# EAGLE design Schematic (EAGLE 8.6.0)
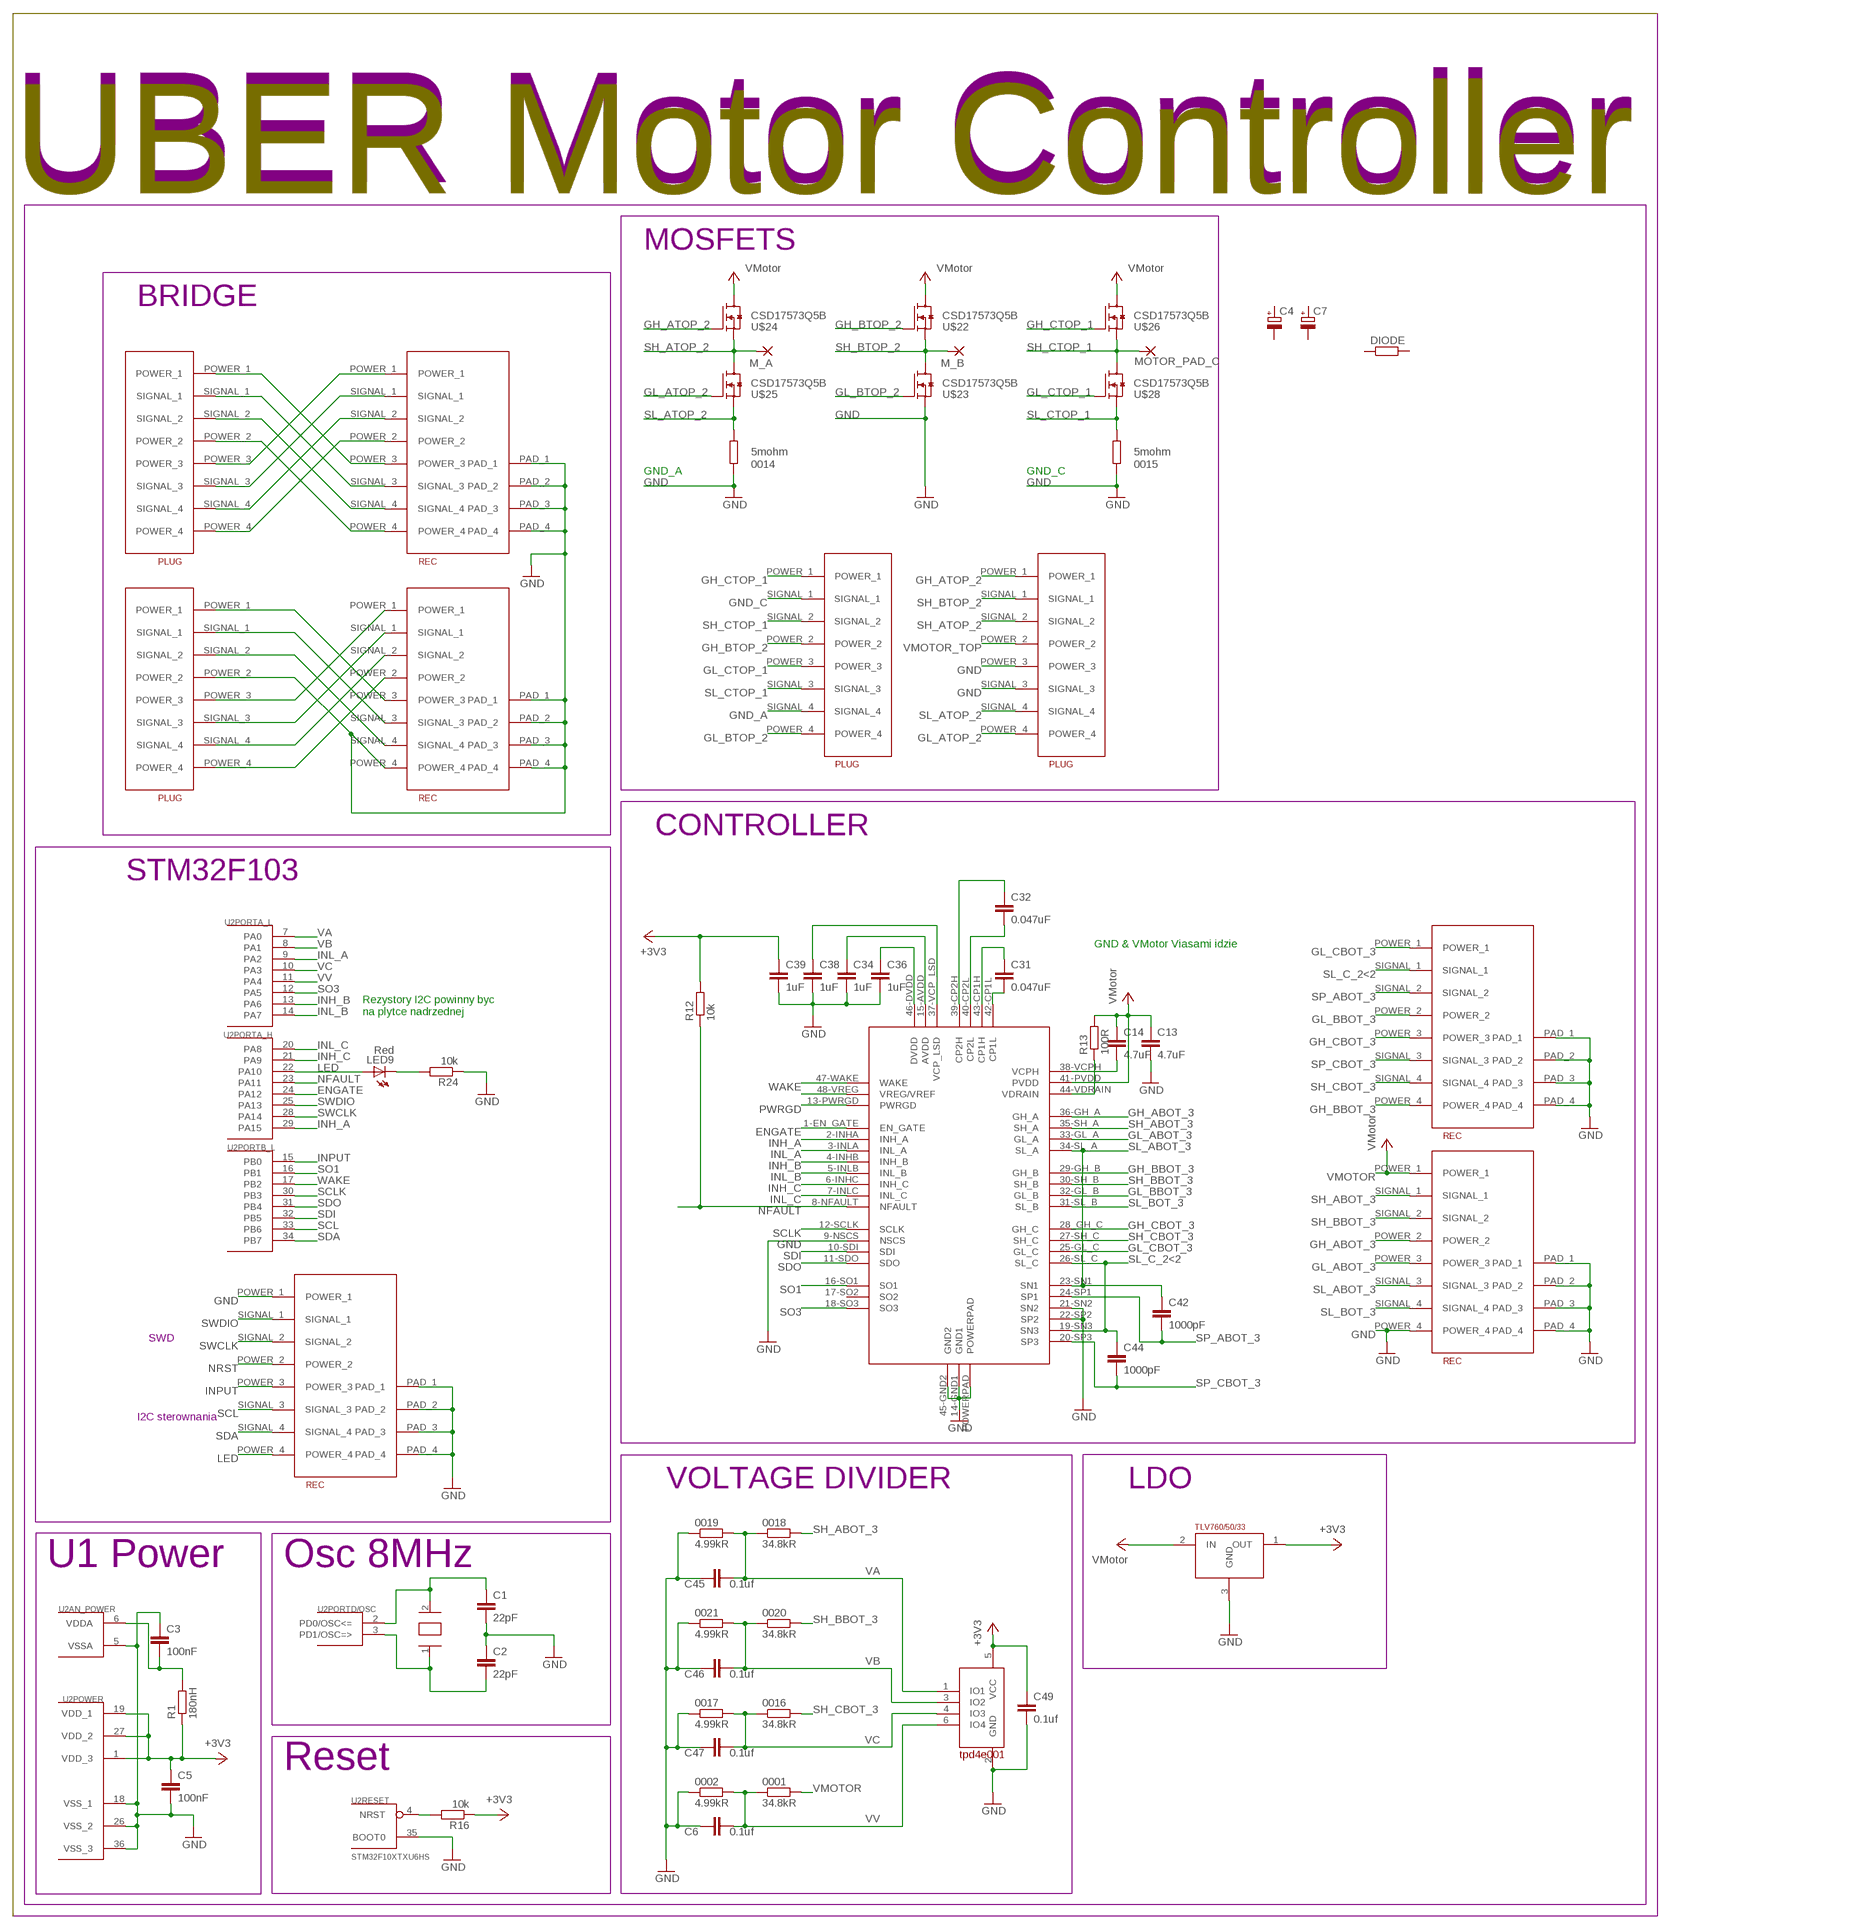
[diagram p0: schematic, sheet 1]

## Parts
0001  34.8kR  R-EU_R0603  [R0603]
0002  4.99kR  R-EU_R0603  [R0603]
0014  5mohm  R-EU_R2512  [R2512]
0015  5mohm  R-EU_R2512  [R2512]
0016  34.8kR  R-EU_R0603  [R0603]
0017  4.99kR  R-EU_R0603  [R0603]
0018  34.8kR  R-EU_R0603  [R0603]
0019  4.99kR  R-EU_R0603  [R0603]
0020  34.8kR  R-EU_R0603  [R0603]
0021  4.99kR  R-EU_R0603  [R0603]
C1  22pF  C-EUC0603  [C0603]
C2  22pF  C-EUC0603  [C0603]
C3  100nF  C-EUC0603  [C0603]
C4  CPOL-EU153CLV-0807  [153CLV-0807]
C5  100nF  C-EUC0603  [C0603]
C6  0.1uf  C-EUC0603  [C0603]
C7  CPOL-EU153CLV-0807  [153CLV-0807]
C13  4.7uF  C-EUC0805  [C0805]
C14  4.7uF  C-EUC0805  [C0805]
C31  0.047uF  C-EUC0603  [C0603]
C32  0.047uF  C-EUC0603  [C0603]
C34  1uF  C-EUC0603  [C0603]
C36  1uF  C-EUC0603  [C0603]
C38  1uF  C-EUC0603  [C0603]
C39  1uF  C-EUC0603  [C0603]
C42  1000pF  C-EUC0603  [C0603]
C44  1000pF  C-EUC0603  [C0603]
C45  0.1uf  C-EUC0603  [C0603]
C46  0.1uf  C-EUC0603  [C0603]
C47  0.1uf  C-EUC0603  [C0603]
C49  0.1uf  C-EUC0603  [C0603]
DIODE  R-EU_R0805  [R0805]
LED9  Red  LEDSML0603  [SML0603]
M_A  SMD5  [SMD2,54-5,08]
M_B  SMD5  [SMD2,54-5,08]
MOTOR_PAD_C  SMD5  [SMD2,54-5,08]
R1  180nH  R-EU_R0603  [R0603]
R12  10k  R-EU_R0603  [R0603]
R13  100R  R-EU_R0603  [R0603]
R16  10k  R-EU_R0603  [R0603]
R24  10k  R-EU_R0603  [R0603]
U2  STM32F10XTXU6HS  [VFQFPN36-HS]
U$1  MOLEG_REC_8X0.4MM  [REC]
U$2  MOLEG_REC_8X0.4MM  [REC]
U$3  MOLEX_PLUG_8X0.4MM  [PLUG]
U$4  MOLEG_REC_8X0.4MM  [REC]
U$5  MOLEG_REC_8X0.4MM  [REC]
U$6  MOLEX_PLUG_8X0.4MM  [PLUG]
U$7  MOLEX_PLUG_8X0.4MM  [PLUG]
U$8  MOLEX_PLUG_8X0.4MM  [PLUG]
U$9  MOLEG_REC_8X0.4MM  [REC]
U$10  OSC_8MHZ  [SMD_MINI]
U$11  TLV760XX  [SOT-23-3]
U$21  DRV8305  [S-PQFP-G48]
U$22  CSD17573Q5B  [Q5B]
U$23  CSD17573Q5B  [Q5B]
U$24  CSD17573Q5B  [Q5B]
U$25  CSD17573Q5B  [Q5B]
U$26  CSD17573Q5B  [Q5B]
U$28  CSD17573Q5B  [Q5B]
U$31  TPD4E001  [SOT-23]

## Nets
+3V3: C5.1 C39.1 C49.1 R1.1 R12.2 R16.1 U2.1(POWER:VDD_3) U2.19(POWER:VDD_1) U2.27(POWER:VDD_2) U$11.1(OUT) U$31.5(VCC)
ENGATE: U2.24(PORTA_H:PA12) U$21.1-EN_GATE(EN_GATE)
GH_ABOT_3: U$9.POWER_2 U$21.36-GH_A(GH_A)
GH_ATOP_2: U$3.POWER_1 U$24.G
GH_BBOT_3: U$4.POWER_4 U$21.29-GH_B(GH_B)
GH_BTOP_2: U$6.POWER_2 U$22.G
GH_CBOT_3: U$4.POWER_3 U$21.28_GH_C(GH_C)
GH_CTOP_1: U$6.POWER_1 U$26.G
GL_ABOT_3: U$9.POWER_3 U$21.33-GL_A(GL_A)
GL_ATOP_2: U$3.POWER_4 U$25.G
GL_BBOT_3: U$4.POWER_2 U$21.32-GL_B(GL_B)
GL_BTOP_2: U$6.POWER_4 U$23.G
GL_CBOT_3: U$4.POWER_1 U$21.25-GL_C(GL_C)
GL_CTOP_1: U$6.POWER_3 U$28.G
GND: 0002.1 0014.1 0015.1 0017.1 0019.1 0021.1 C1.2 C2.1 C3.1 C5.2 C6.2 C13.2 C34.2 C36.2 C38.2 C39.2 C45.2 C46.2 C47.2 C49.2 R24.1 U2.5(AN_POWER:VSSA) U2.18(POWER:VSS_1) U2.26(POWER:VSS_2) U2.35(RESET:BOOT0) U2.36(POWER:VSS_3) U$1.PAD_1 U$1.PAD_2 U$1.PAD_3 U$1.PAD_4 U$2.PAD_1 U$2.PAD_2 U$2.PAD_3 U$2.PAD_4 U$2.POWER_1 U$3.POWER_3 U$3.SIGNAL_3 U$4.PAD_1 U$4.PAD_2 U$4.PAD_3 U$4.PAD_4 U$5.PAD_1 U$5.PAD_2 U$5.PAD_3 U$5.PAD_4 U$5.POWER_4 U$8.POWER_2 U$9.PAD_1 U$9.PAD_2 U$9.PAD_3 U$9.PAD_4 U$9.POWER_4 U$11.3(GND) U$21.9-NSCS(NSCS) U$21.14-GND1(GND1) U$21.21-SN2(SN2) U$21.22-SP2(SP2) U$21.45-GND2(GND2) U$21.POWERPAD U$23.S1(S) U$23.S2(S) U$23.S3(S) U$31.2(GND)
GND_A: U$6.SIGNAL_4
GND_C: U$6.SIGNAL_1
INH_A: U2.29(PORTA_H:PA15) U$21.2-INHA(INH_A)
INH_B: U2.13(PORTA_L:PA6) U$21.4-INHB(INH_B)
INH_C: U2.21(PORTA_H:PA9) U$21.6-INHC(INH_C)
INL_A: U2.9(PORTA_L:PA2) U$21.3-INLA(INL_A)
INL_B: U2.14(PORTA_L:PA7) U$21.5-INLB(INL_B)
INL_C: U2.20(PORTA_H:PA8) U$21.7-INLC(INL_C)
INPUT: U2.15(PORTB_L:PB0) U$2.POWER_3
LED: LED9.A U2.22(PORTA_H:PA10) U$2.POWER_4
N$2: U$21.48-VREG(VREG/VREF)
N$3: U$5.POWER_3 U$8.POWER_1
N$4: U$5.SIGNAL_3 U$8.SIGNAL_1
N$5: U$5.SIGNAL_4 U$8.SIGNAL_2
N$7: U$1.POWER_3 U$7.POWER_1
N$8: U$1.SIGNAL_3 U$7.SIGNAL_1
N$9: U$1.SIGNAL_4 U$7.SIGNAL_2
N$10: C36.1 U$21.46-DVDD(DVDD)
N$11: U$1.POWER_4 U$7.POWER_2
N$12: C34.1 U$21.15-AVDD(AVDD)
N$13: C38.1 U$21.37-VCP_LSD(VCP_LSD)
N$14: C31.2 U$21.42-CP1L(CP1L)
N$15: U$5.POWER_1 U$8.POWER_3
N$16: C31.1 U$21.43-CP1H(CP1H)
N$17: U$5.SIGNAL_1 U$8.SIGNAL_3
N$18: U$5.SIGNAL_2 U$8.SIGNAL_4
N$19: U$5.POWER_2 U$8.POWER_4
N$20: C32.2 U$21.40-CP2L(CP2L)
N$21: C32.1 U$21.39-CP2H(CP2H)
N$22: R13.1 U$21.44-VDRAIN(VDRAIN)
N$23: C14.2 U$21.38-VCPH(VCPH)
N$24: C1.1 U2.2(PORTD/OSC:PD0/OSC<=) U$10.2
N$25: U$1.POWER_1 U$7.POWER_3
N$26: U$1.SIGNAL_1 U$7.SIGNAL_3
N$27: U$1.SIGNAL_2 U$7.SIGNAL_4
N$28: U$1.POWER_2 U$7.POWER_4
N$45: C3.2 R1.2 U2.6(AN_POWER:VDDA)
N$53: C2.2 U2.3(PORTD/OSC:PD1/OSC=>) U$10.1
N$81: LED9.C R24.2
NFAULT: R12.1 U2.23(PORTA_H:PA11) U$21.8-NFAULT(NFAULT)
NRST: R16.2 U2.4(RESET:NRST) U$2.POWER_2
PWRGD: U$21.13-PWRGD(PWRGD)
SCL: U2.33(PORTB_L:PB6) U$2.SIGNAL_3
SCLK: U2.30(PORTB_L:PB3) U$21.12-SCLK(SCLK)
SDA: U2.34(PORTB_L:PB7) U$2.SIGNAL_4
SDI: U2.32(PORTB_L:PB5) U$21.10-SDI(SDI)
SDO: U2.31(PORTB_L:PB4) U$21.11-SDO(SDO)
SH_ABOT_3: 0018.2 U$9.SIGNAL_1 U$21.35-SH_A(SH_A)
SH_ATOP_2: M_A.1(P) U$3.SIGNAL_2 U$24.S1(S) U$24.S2(S) U$24.S3(S) U$25.D1(D) U$25.D2(D) U$25.D3(D) U$25.D4(D) U$25.D5(D)
SH_BBOT_3: 0020.2 U$9.SIGNAL_2 U$21.30-SH_B(SH_B)
SH_BTOP_2: M_B.1(P) U$3.SIGNAL_1 U$22.S1(S) U$22.S2(S) U$22.S3(S) U$23.D1(D) U$23.D2(D) U$23.D3(D) U$23.D4(D) U$23.D5(D)
SH_CBOT_3: 0016.2 U$4.SIGNAL_4 U$21.27-SH_C(SH_C)
SH_CTOP_1: MOTOR_PAD_C.1(P) U$6.SIGNAL_2 U$26.S1(S) U$26.S2(S) U$26.S3(S) U$28.D1(D) U$28.D2(D) U$28.D3(D) U$28.D4(D) U$28.D5(D)
SL_ABOT_3: C42.1 U$9.SIGNAL_3 U$21.23-SN1(SN1) U$21.34-SL_A(SL_A)
SL_ATOP_2: 0014.2 U$3.SIGNAL_4 U$25.S1(S) U$25.S2(S) U$25.S3(S)
SL_BOT_3: U$9.SIGNAL_4 U$21.31-SL_B(SL_B)
SL_C_2<2: C44.1 U$4.SIGNAL_1 U$21.19-SN3(SN3) U$21.26-SL_C(SL_C)
SL_CTOP_1: 0015.2 U$6.SIGNAL_3 U$28.S1(S) U$28.S2(S) U$28.S3(S)
SO1: U2.16(PORTB_L:PB1) U$21.16-SO1(SO1)
SO3: U2.12(PORTA_L:PA5) U$21.18-SO3(SO3)
SP_ABOT_3: C42.2 U$4.SIGNAL_2 U$21.24-SP1(SP1)
SP_CBOT_3: C44.2 U$4.SIGNAL_3 U$21.20-SP3(SP3)
SWCLK: U2.28(PORTA_H:PA14) U$2.SIGNAL_2
SWDIO: U2.25(PORTA_H:PA13) U$2.SIGNAL_1
VA: 0018.1 0019.2 C45.1 U2.7(PORTA_L:PA0) U$31.1(IO1)
VB: 0020.1 0021.2 C46.1 U2.8(PORTA_L:PA1) U$31.3(IO2)
VC: 0016.1 0017.2 C47.1 U2.10(PORTA_L:PA3) U$31.4(IO3)
VMOTOR: 0001.2 C13.1 C14.1 R13.2 U$9.POWER_1 U$11.2(IN) U$21.41-PVDD(PVDD) ; supply symbol labelled VMotor
VMOTOR_TOP: U$3.POWER_2 U$22.D1(D) U$22.D2(D) U$22.D3(D) U$22.D4(D) U$22.D5(D) U$24.D1(D) U$24.D2(D) U$24.D3(D) U$24.D4(D) U$24.D5(D) U$26.D1(D) U$26.D2(D) U$26.D3(D) U$26.D4(D) U$26.D5(D) ; supply symbol labelled VMotor
VV: 0001.1 0002.2 C6.1 U2.11(PORTA_L:PA4) U$31.6(IO4)
WAKE: U2.17(PORTB_L:PB2) U$21.47-WAKE(WAKE)
Unconnected: C4.+ C4.- C7.+ C7.- DIODE.1 DIODE.2 U$21.17-SO2(SO2)

## Notes on the sheet
- UBER Motor Controller | UBER Motor Controller
- MOSFETS
- BRIDGE
- GND_A | GND_C
- CONTROLLER
- STM32F103
- GND & VMotor Viasami idzie
- Rezystory I2C powinny byc 
  na plytce nadrzednej
- SWD
- I2C sterownania
- VOLTAGE DIVIDER | LDO
- U1 Power | Osc 8MHz
- Reset

## Library data of the parts
0001 0002 0014-0021 R1 R12 R13 R16 R24 = resistor:R-EU_: RESISTOR, European symbol
C1-C3 C5 C6 C13 C14 C31 C32 C34 C36 C38 C39 C42 C44-C47 C49 = rcl:C-EU: CAPACITOR, European symbol; SPICEPREFIX: C
C4 C7 = rcl:CPOL-EU: POLARIZED CAPACITOR, European symbol; SPICEPREFIX: C
DIODE = rcl:R-EU_: RESISTOR, European symbol; SPICEPREFIX: R
LED9 = led:LED: LED OSRAM: - CHIPLED LG R971, LG N971, LY N971, LG Q971, LY Q971, LO R971, LY R971 LH N974, LH R974 LS Q976, LO Q976, LY Q976 LO Q996 - Hyper CHIPLED LW Q18S LB Q993, LB Q99A, LB R99A - SideLED LS A670, LO A670, LY A670, LG A670, LP A670 LB A673, LV A673, LT A673, LW A673 LH A674 LY A675 LS A676, LA A676, LO A676, LY A676, LW A676 LS A679, LY A679, LG A679 - Hyper Micro SIDELED® LS Y876, LA Y876, LO Y876, LY Y876 LT Y87S - SmartLED LW L88C, LW L88S LB L89C, LB L89S, LG L890 LS L89K, LO L89K, LY L89K LS L896, LA L896, LO L896, LY L896 - TOPLED LS T670, LO T670, LY T670, LG T670, LP T670 LSG T670, LSP T670, LSY T670, LOP T670, LYG T670 LG T671, LOG T671, LSG T671 LB T673, LV T673, LT T673, LW T673 LH T674 LS T676, LA T676, LO T676, LY T676, LB T676, LH T676, LSB T676, LW T676 LB T67C, LV T67C, LT T67C, LS T67K, LO T67K, LY T67K, LW E67C LS E67B, LA E67B, LO E67B, LY E67B, LB E67C, LV E67C, LT E67C LW T67C LS T679, LY T679, LG T679 LS T770, LO T770, LY T770, LG T770, LP T770 LB T773, LV T773, LT T773, LW T773 LH T774 LS E675, LA E675, LY E675, LS T675 LS T776, LA T776, LO T776, LY T776, LB T776 LHGB T686 LT T68C, LB T68C - Hyper Mini TOPLED® LB M676 - Mini TOPLED Santana® LG M470 LS M47K, LO M47K, LY M47K Source: http://www.osram.convergy.de LUXEON: - LUMILED® LXK2-PW12-R00, LXK2-PW12-S00, LXK2-PW14-U00, LXK2-PW14-V00 LXK2-PM12-R00, LXK2-PM12-S00, LXK2-PM14-U00 LXK2-PE12-Q00, LXK2-PE12-R00, LXK2-PE12-S00, LXK2-PE14-T00, LXK2-PE14-U00 LXK2-PB12-K00, LXK2-PB12-L00, LXK2-PB12-M00, LXK2-PB14-N00, LXK2-PB14-P00, LXK2-PB14-Q00 LXK2-PR12-L00, LXK2-PR12-M00, LXK2-PR14-Q00, LXK2-PR14-R00 LXK2-PD12-Q00, LXK2-PD12-R00, LXK2-PD12-S00 LXK2-PH12-R00, LXK2-PH12-S00 LXK2-PL12-P00, LXK2-PL12-Q00, LXK2-PL12-R00 Source: www.luxeon.com KINGBRIGHT: KA-3528ASYC Source: www.kingbright.com
M_A M_B MOTOR_PAD_C = wirepad:SMD5: SMD PAD
U2 = stm32:STM32F10XTXU6: STM32F101/103 36pad VFQPFN36
U$1 U$2 U$4 U$5 U$9 = MOLEX:MOLEG_REC_8X0.4MM
U$3 U$6-U$8 = MOLEX:MOLEX_PLUG_8X0.4MM
U$10 = OSC_8MHZ:OSC_8MHZ
U$11 = Zestaw:TLV760XX
U$21 = drv8305lbr:DRV8305
U$22-U$26 U$28 = CSD_Mosfet:CSD17573Q5B
U$31 = tpd4e001:TPD4E001

## Board
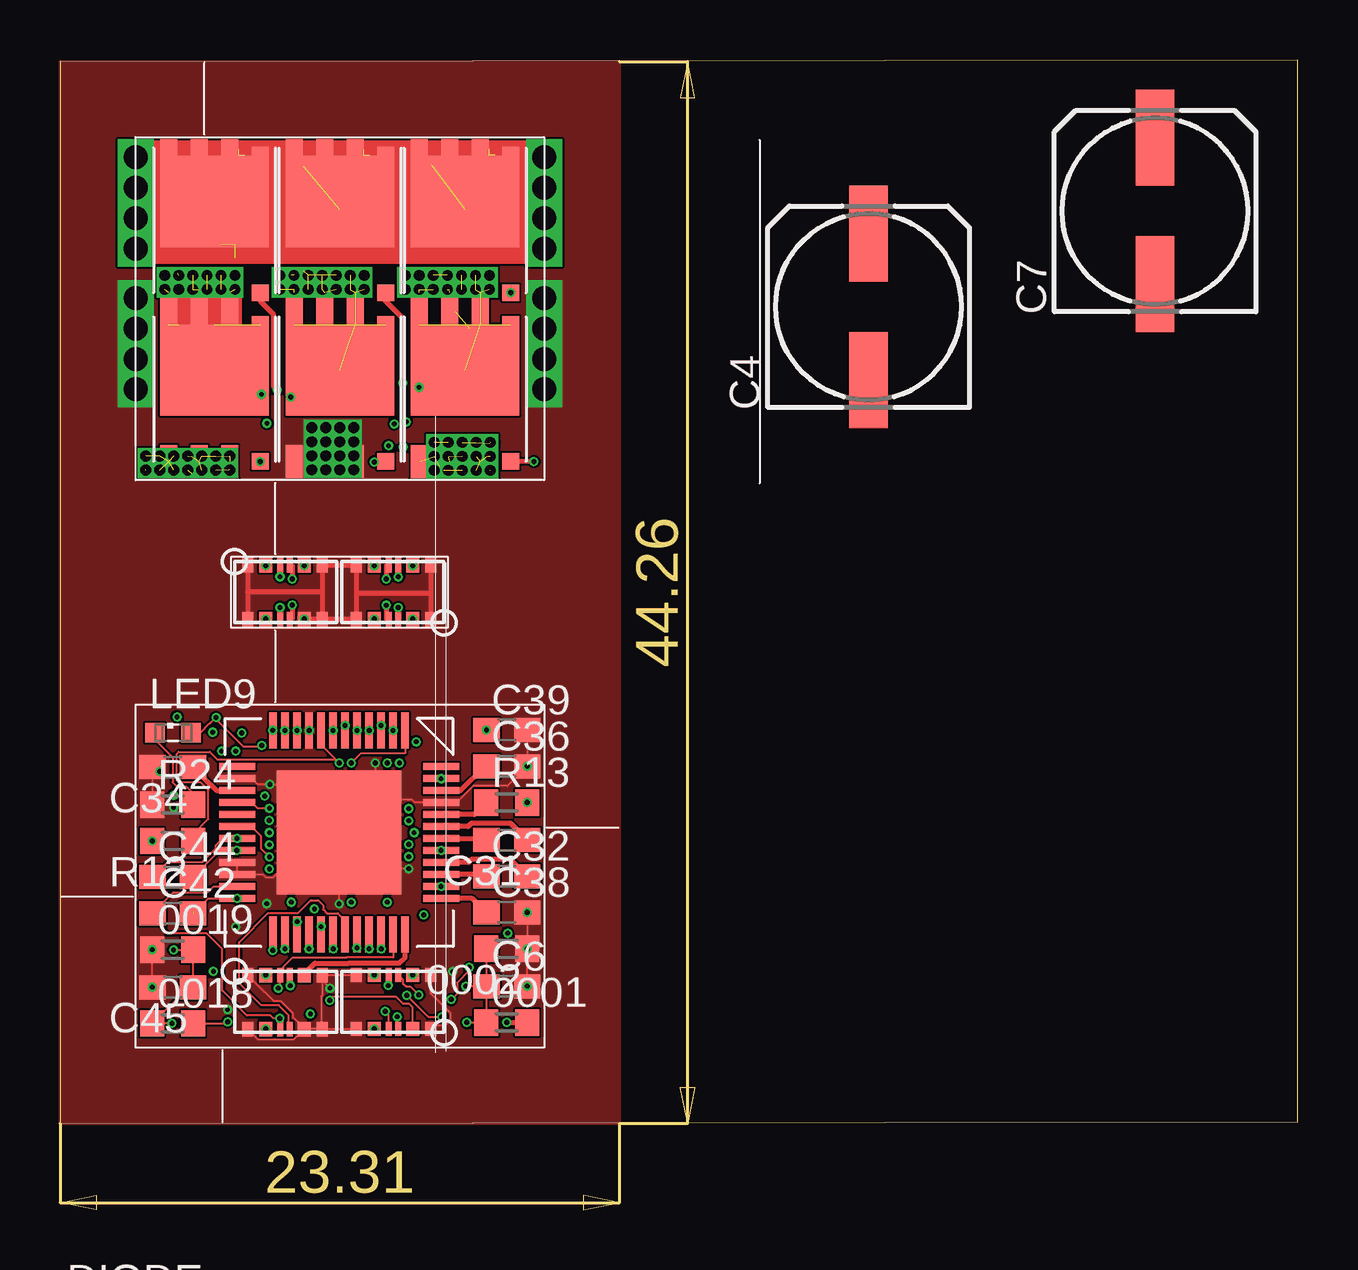
[diagram p1: board, top side]
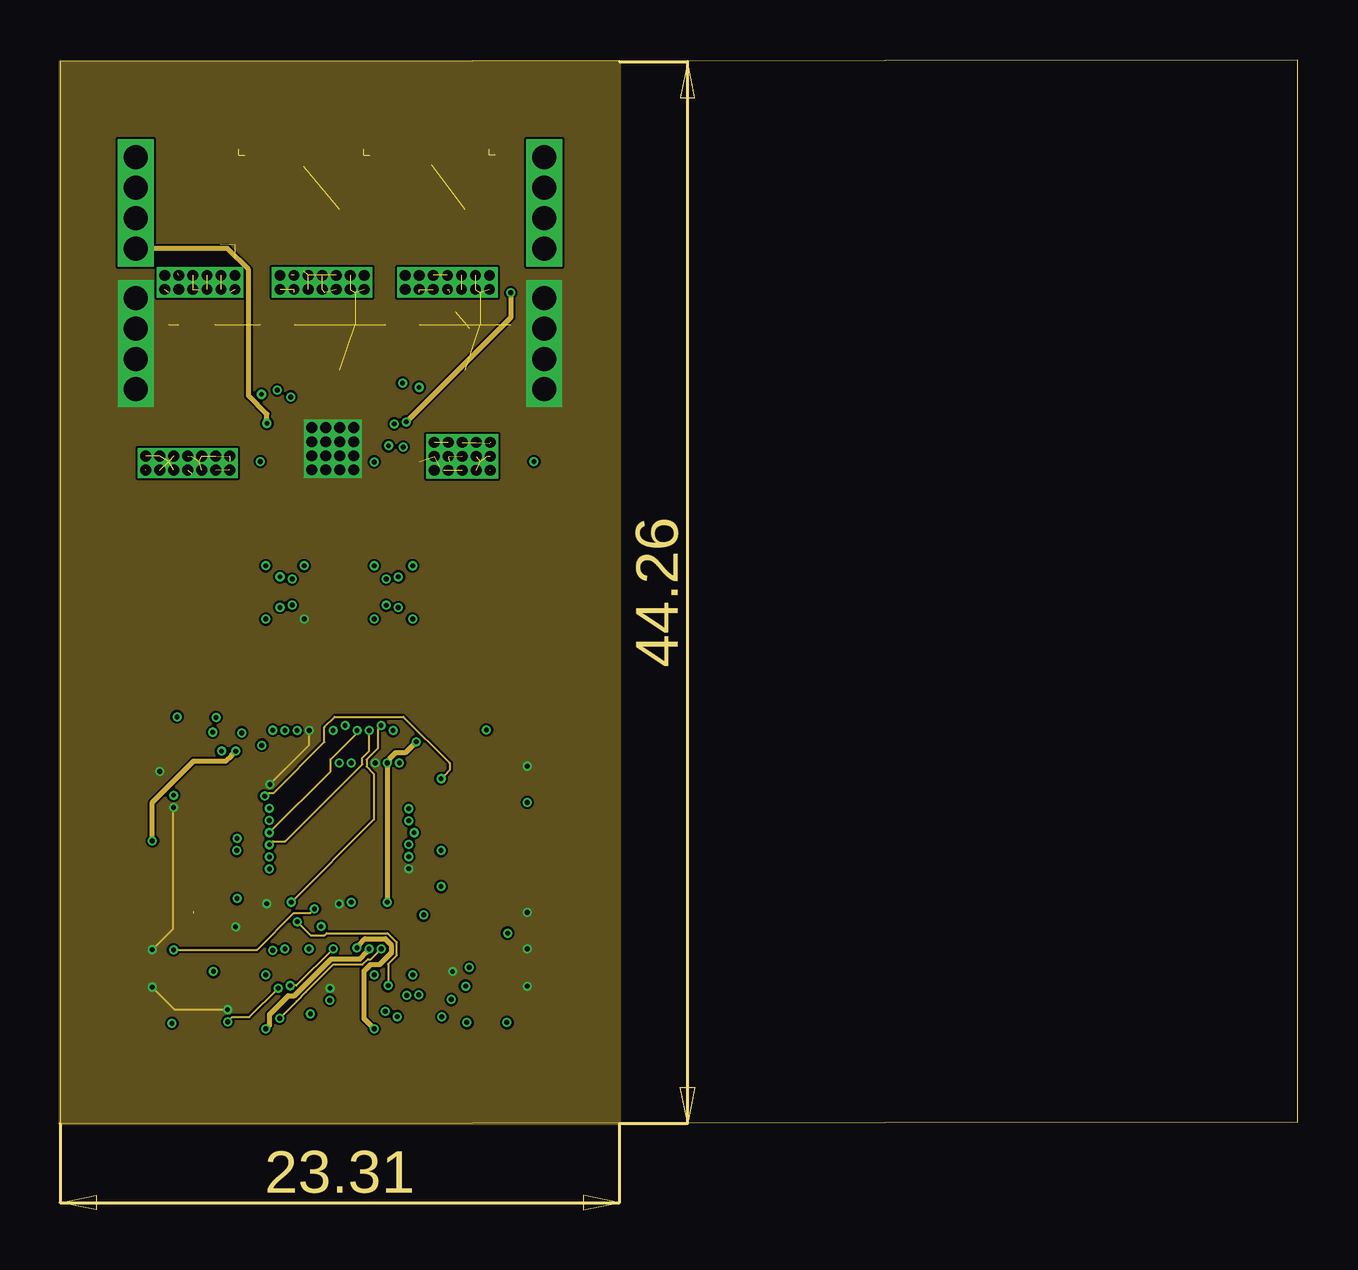
[diagram p2: board, inner layer Route2]
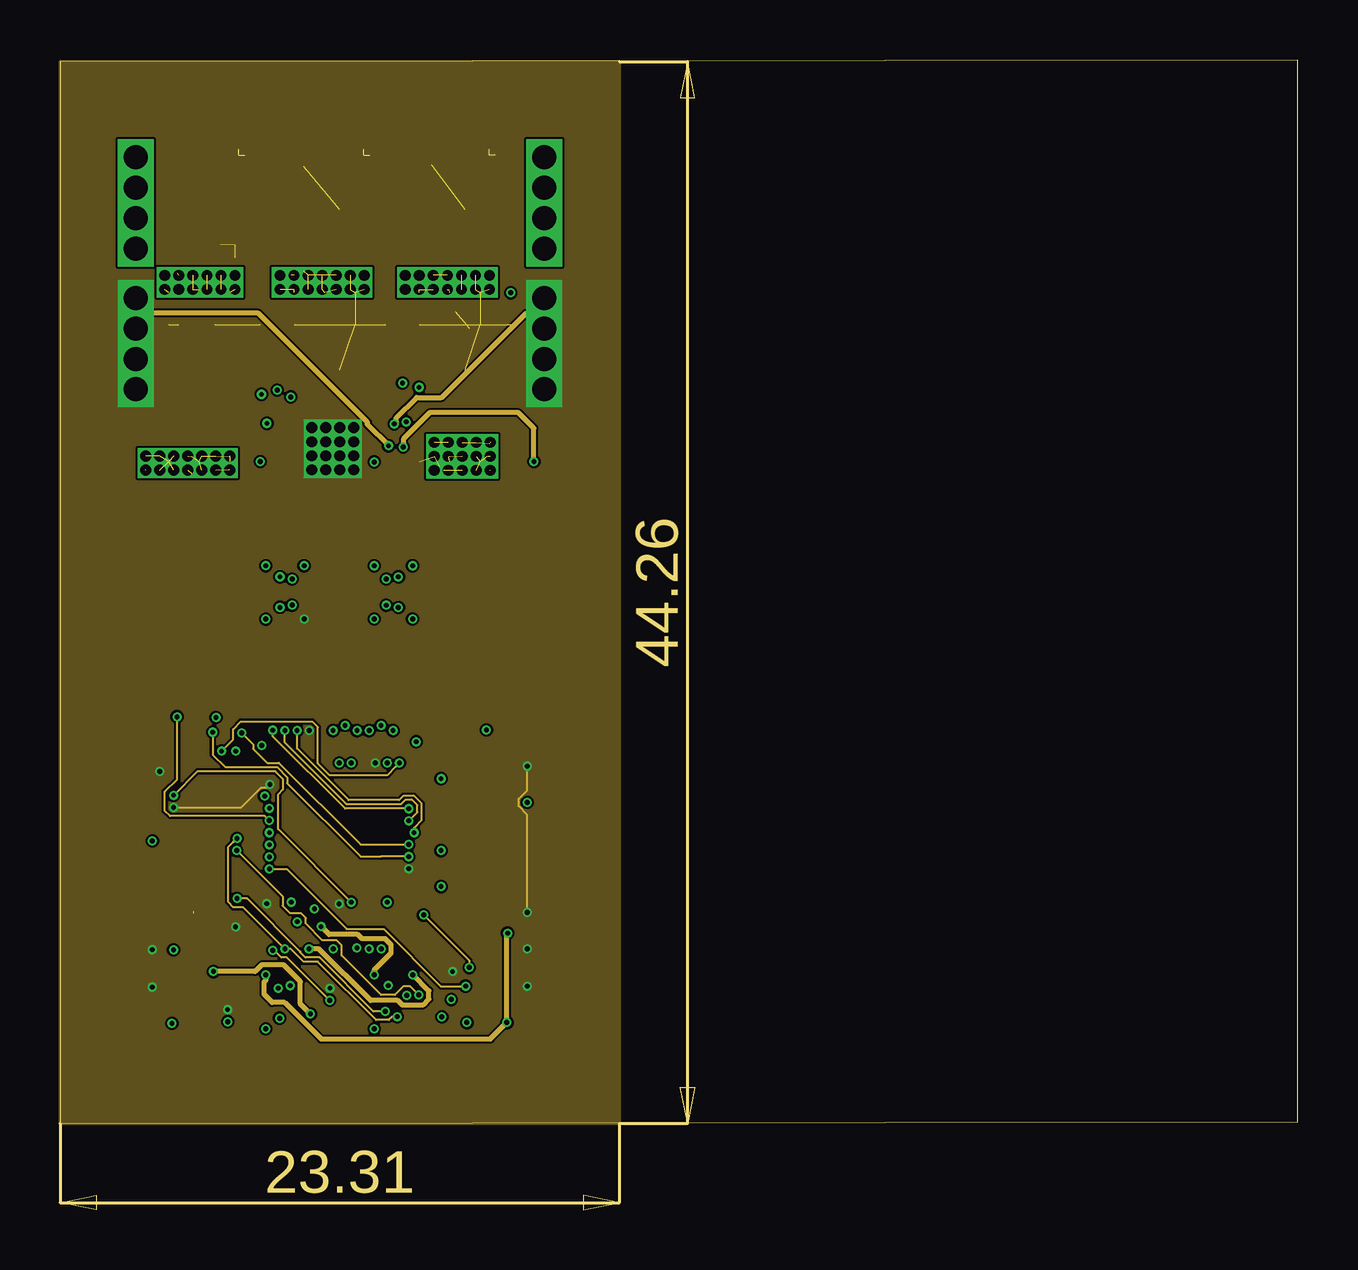
[diagram p3: board, inner layer Route15]
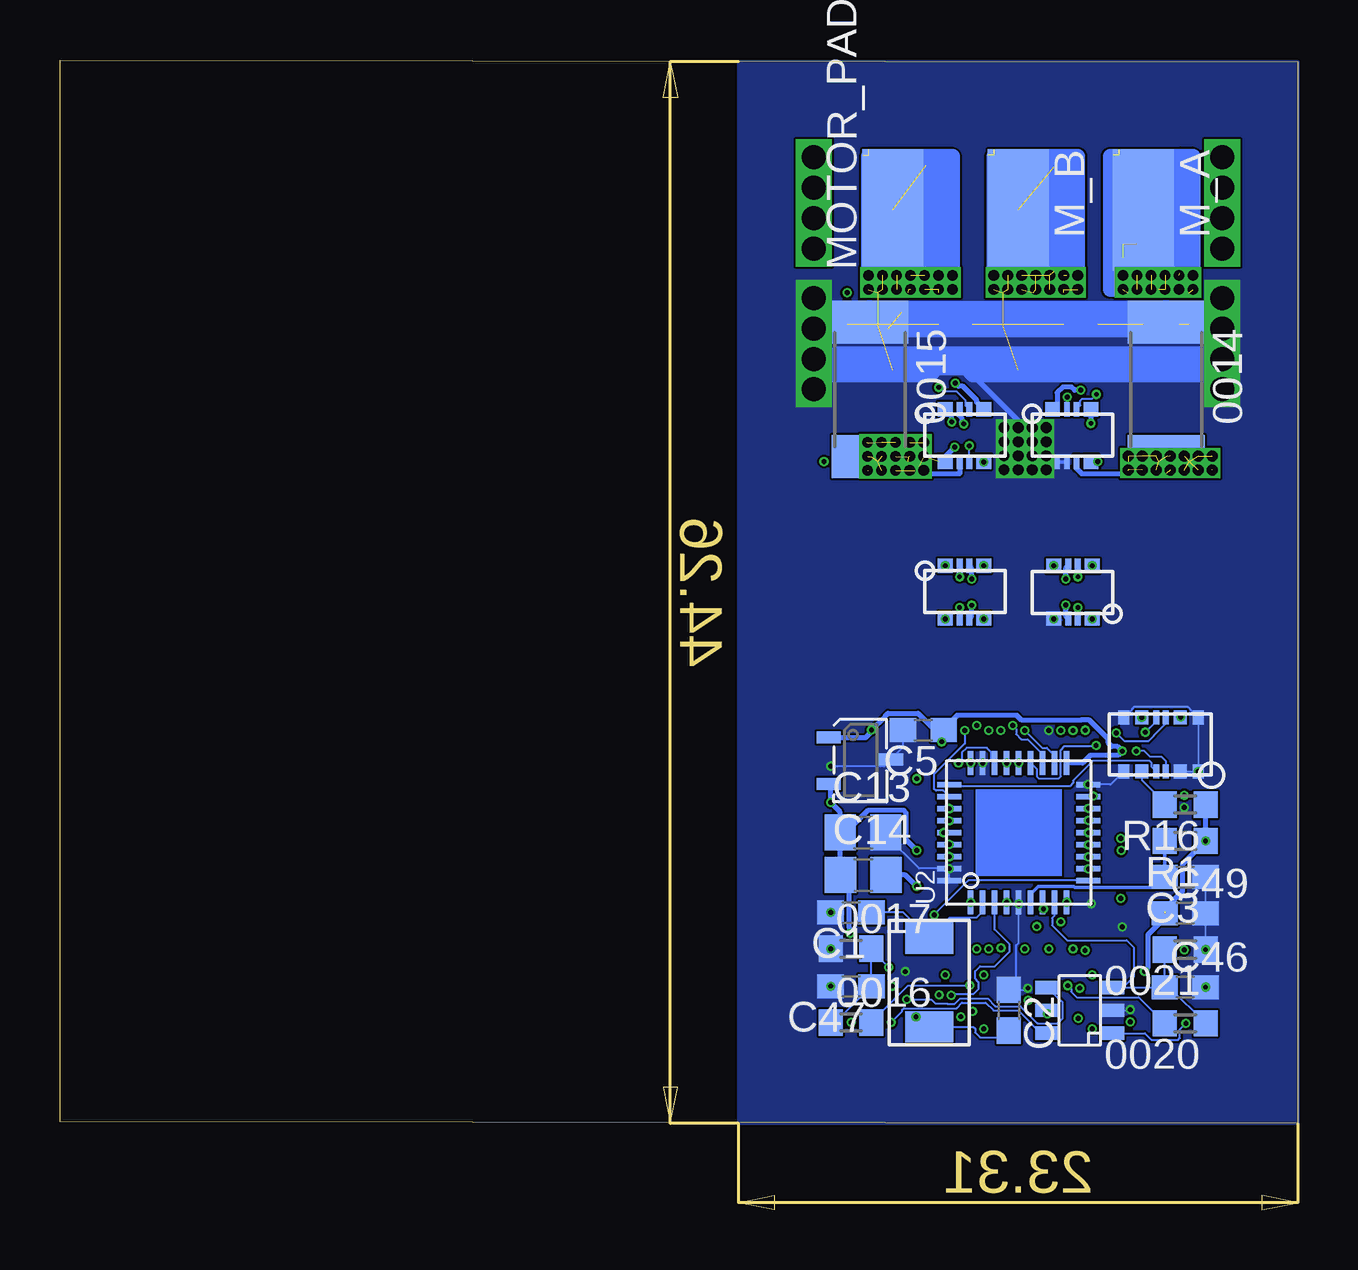
[diagram p4: board, bottom side, seen from below]

Size 51.58 x 44.32 mm. Coordinates in mm from the lower left corner, seen from the top.
Outline: 7.7,40.35 7.44,40.35 7.44,40.6
Outline: 12.92,40.35 12.66,40.35 12.66,40.6
Outline: 17.88,40.6 17.88,40.35 18.14,40.35
Outline: 0,0 51.58,0.06 51.58,44.32 0,44.26 0,0
Copper layers (1*2*15*16): Top 0.035mm / dielectric 0.2mm / Route2 0.017mm / dielectric 0.2mm / Route15 0.017mm / dielectric 0.2mm / Bottom 0.035mm
Design rules "default *": minimum track width 3.5mil, minimum drill 0.2mm, track to track 3.5mil, track to pad 3.5mil, pad to pad 3.5mil, via to via 5mil, smd to smd 0mil, copper to edge 0mil, drill to drill 6mil, minimum pad ring 3.5mil, minimum via ring 3.5mil, stop-mask expansion 4mil, vias tented up to drill 0mil, thermal gap 0mil

### Footprints (pad centres in the part's own frame; a part is rotated, then mirrored left to right if it is on the bottom)
R0603 = smd 1 x 1.1: 1 -0.85,0; 2 0.85,0
R2512 = smd 1.8 x 3.2: 1 -2.8,0; 2 2.8,0
C0603 = smd 1.1 x 1: 1 -0.85,0; 2 0.85,0
153CLV-0807 = smd 4 x 1.6: + 3.05,0; - -3.05,0
C0805 = smd 1.3 x 1.5: 1 -0.95,0; 2 0.95,0
R0805 = smd 1.3 x 1.5: 1 -0.95,0; 2 0.95,0
SML0603 = smd 0.8 x 0.8: A 0.75,0; C -0.75,0
SMD2,54-5,08 = smd 2.54 x 5.08: 1 0,0
VFQFPN36-HS = smd 1 x 0.23: 1 -2.9,2; 2 -2.9,1.5; 3 -2.9,1; 4 -2.9,0.5; 5 -2.9,0; 6 -2.9,-0.5; 7 -2.9,-1; 8 -2.9,-1.5; 9 -2.9,-2; 19 2.9,-2; 20 2.9,-1.5; 21 2.9,-1; 22 2.9,-0.5; 23 2.9,0; 24 2.9,0.5; 25 2.9,1; 26 2.9,1.5; 27 2.9,2 | smd 0.23 x 1: 10 -2,-2.9; 11 -1.5,-2.9; 12 -1,-2.9; 13 -0.5,-2.9; 14 0,-2.9; 15 0.5,-2.9; 16 1,-2.9; 17 1.5,-2.9; 18 2,-2.9; 28 2,2.9; 29 1.5,2.9; 30 1,2.9; 31 0.5,2.9; 32 0,2.9; 33 -0.5,2.9; 34 -1,2.9; 35 -1.5,2.9; 36 -2,2.905
REC = smd 0.45 x 0.6: PAD_1 -0.75,0; PAD_2 2.35,0; PAD_3 -0.75,-2.25; PAD_4 2.35,-2.25 | smd 0.55 x 0.6: POWER_1 0,0; POWER_2 1.6,0; POWER_3 0,-2.25; POWER_4 1.6,-2.25 | smd 0.24 x 0.6: SIGNAL_1 0.6,0; SIGNAL_2 1,0; SIGNAL_3 0.6,-2.25; SIGNAL_4 1,-2.25
PLUG = smd 0.62 x 0.6: POWER_1 0,0; POWER_2 1.6,0; POWER_3 0,-2.2; POWER_4 1.6,-2.2 | smd 0.24 x 0.6: SIGNAL_1 0.6,0; SIGNAL_2 1,0; SIGNAL_3 0.6,-2.2; SIGNAL_4 1,-2.2
SMD_MINI = smd 1.3 x 2: 1 -1.85,0; 2 1.85,0
SOT-23-3 = smd 0.508 x 1.016: 1 -0.941,-1.312; 2 0.986,-1.312; 3 -0.03,1.282
S-PQFP-G48 = smd 0.3 x 1.5: 1-EN_GATE 0,0; 2-INHA 0.5,0; 3-INLA 1,0; 4-INHB 1.5,0; 5-INLB 2,0; 6-INHC 2.5,0; 7-INLC 3,0; 8-NFAULT 3.5,0; 9-NSCS 4,0; 10-SDI 4.5,0; 11-SDO 5,0; 12-SCLK 5.5,0; 25-GL_C 5.5,8.5; 26-SL_C 5,8.5; 27-SH_C 4.5,8.5; 28_GH_C 4,8.5; 29-GH_B 3.5,8.5; 30-SH_B 3,8.5; 31-SL_B 2.5,8.5; 32-GL_B 2,8.5; 33-GL_A 1.5,8.5; 34-SL_A 1,8.5; 35-SH_A 0.5,8.5; 36-GH_A 0,8.5 | smd 1.5 x 0.3: 13-PWRGD 7,1.5; 14-GND1 7,2; 15-AVDD 7,2.5; 16-SO1 7,3; 17-SO2 7,3.5; 18-SO3 7,4; 19-SN3 7,4.5; 20-SP3 7,5; 21-SN2 7,5.5; 22-SP2 7,6; 23-SN1 7,6.5; 24-SP1 7,7; 37-VCP_LSD -1.5,7; 38-VCPH -1.5,6.5; 39-CP2H -1.5,6; 40-CP2L -1.5,5.5; 41-PVDD -1.5,5; 42-CP1L -1.5,4.5; 43-CP1H -1.5,4; 44-VDRAIN -1.5,3.5; 45-GND2 -1.5,3; 46-DVDD -1.5,2.5; 47-WAKE -1.5,2; 48-VREG -1.5,1.5 | smd 5.17 x 5.17: POWERPAD 2.75,4.25
Q5B = smd 3.8 x 4.52: D1 0,-0.635 | smd 0.686 x 0.71: D2 -1.905,1.27; G 3.81,1.27 | smd 1.372 x 0.71: D3 -1.905,0; D4 -1.905,-1.27; D5 -1.905,-2.54; S1 3.81,0; S2 3.81,-1.27; S3 3.81,-2.54
SOT-23 = smd 0.55 x 1: 1 0,0; 2 0.95,0; 3 1.9,0; 4 1.9,2.7; 5 0.95,2.7; 6 0,2.7

### Placement (x,y rotation side)
0001  18.62,4.2 0 top
0002  18.62,7.28 180 top
0014  5.49,30.59 270 bottom
0015  17.83,30.59 270 bottom
0016  18.62,4.2 0 bottom
0017  18.62,7.28 0 bottom
0018  4.7,4.17 0 top
0019  4.7,7.24 0 top
0020  4.7,4.17 180 bottom
0021  4.7,7.24 180 bottom
C1  18.62,8.79 180 bottom
C2  12.05,4.71 270 bottom
C3  4.7,10.26 180 bottom
C4  33.69,34.04 90 top
C5  15.61,16.4 180 bottom
C6  18.62,5.71 0 top
C7  45.63,38.02 90 top
C13  18.12,12.12 0 bottom
C14  18.11,10.35 0 bottom
C31  18.62,11.81 180 top
C32  18.62,10.3 0 top
C34  4.7,14.85 180 top
C36  18.62,14.88 0 top
C38  18.62,8.79 0 top
C39  18.62,16.4 0 top
C42  4.7,8.75 0 top
C44  4.7,10.26 0 top
C45  4.7,5.68 180 top
C46  4.7,5.68 0 bottom
C47  18.62,5.71 180 bottom
C49  4.7,8.75 0 bottom
DIODE  0.91,-8.42 0 top  (outside the outline)
LED9  4.71,16.28 0 top
M_A  6.44,38.07 180 bottom
M_B  11.66,38.07 180 bottom
MOTOR_PAD_C  16.88,38.07 0 bottom
R1  4.7,11.77 180 bottom
R12  4.7,11.77 180 top
R13  18.62,13.37 0 top
R16  4.7,13.28 180 bottom
R24  4.7,13.28 0 top
U2  11.63,12.12 90 bottom
U$1  14.69,21.02 180 top
U$2  4.9,14.67 180 bottom
U$3  10.22,29.77 0 bottom
U$4  14.69,3.94 180 top
U$5  8.57,23.27 0 top
U$6  14.69,29.77 0 bottom
U$7  14.69,23.24 0 bottom
U$8  8.57,21.04 180 bottom
U$9  8.57,6.18 0 top
U$10  15.37,5.87 90 bottom
U$11  18.24,15.14 270 bottom
U$21  14.38,16.37 180 top
U$22  12.29,38.43 270 top
U$23  12.29,31.39 270 top
U$24  7.07,38.43 270 top
U$25  7.07,31.39 270 top
U$26  17.51,38.43 270 top
U$28  17.51,31.39 270 top
U$31  7.73,3.76 90 bottom

### Tracks (layer width: path | path; a pad name or v marks a point on that pad's centre or on a via)
+3V3  (via drill 0.2)  (2 unrouted)
  Route2 0.089: 13.78,15.17
  Route2 0.203: v14.84,15.9 14.38,15.44 13.97,15.44 13.72,15.19 13.72,15.11 v13.64,15.02 U2.1 | v7.32,15.51 7.15,15.34 6.9,15.1 5.56,15.1 3.85,13.38 R1.1
  Route15 0.203: v10.43,4.56 10.01,4.98 10.01,5.91 9.32,6.6 8.4,6.6 8.13,6.33 v6.39,6.33
  Bottom 0.089: U$31.5 v10.43,4.56 | U2.27 v13.64,15.02 | v13.64,15.02 | C39.1 17.7,16.4 | 15.22,16.4 14.81,16.4 C5.1 | v14.84,15.9 14.76,15.99 C5.1 | 7.46,15.56 7.46,15.57 7.38,15.57 v7.32,15.51 | 14.36,16.4 14.58,16.4 C5.1
  Bottom 0.152: 9.59,15.02 U2.19 | 14.41,16.4 14.58,16.4
  Bottom 0.203: U$11.1 18.01,16.08 17.7,16.4 | C39.1 17.2,16.96 17.2,16.98 17.09,17.09 15.83,17.09 15.14,16.4 14.81,16.4 14.2,17 11.71,17 11.5,16.8 9.04,16.8 8.69,16.8 7.9,16.01 7.9,15.85 7.76,15.71 7.51,15.71 v7.32,15.51 7.5,15.34 8.65,15.34 8.97,15.02 9.59,15.02 | v6.39,6.33 6.24,6.48 6.24,7.87 5.55,8.56 5.55,8.84 | C49.1 5.55,8.94 4.81,9.68 4.81,10.81 R1.1 R16.1
  other vias: 13.63,9.22 3.85,11.77 17.77,16.4
ENGATE  (via drill 0.2)
  Top 0.089: U$21.1-EN_GATE 14.38,15.42 12.54,15.42 v12.14,15.02
  Bottom 0.089: v12.14,15.02 | v12.14,15.02 U2.24
GH_ABOT_3
  Top 0.203: U$9.POWER_2 10.17,6.23 10.62,6.67 12.04,6.67 12.04,6.68 14.14,6.68 14.38,6.91 U$21.36-GH_A
GH_ATOP_2  (via drill 0.2)
  Top 0.203: U$24.G 8.34,34.27 8.89,33.72 8.89,30.73 v9.05,30.56
  Bottom 0.203: v9.05,30.56 9.31,30.56 9.44,30.69 9.79,30.69 10.03,30.45 10.03,29.96 U$3.POWER_1
GH_BBOT_3  (via drill 0.2)
  Top 0.203: v10.88,8.2 U$21.29-GH_B
  Route15 0.203: U$4.POWER_4 13.09,6.39 13.8,7.1 13.8,7.45 13.56,7.69 12.59,7.69 12.41,7.87 11.21,7.87 v10.88,8.2
  other vias: 13.09,6.19
GH_BTOP_2  (via drill 0.2)
  Top 0.203: U$22.G 13.56,34.27 14.28,33.56 v14.28,30.86
  Bottom 0.203: v14.28,30.86 14.15,30.73 13.96,30.73 13.38,30.15 13.38,30.06 U$6.POWER_2
GH_CBOT_3  (via drill 0.2)
  Top 0.203: U$21.28_GH_C v10.38,7.27 | v10.38,7.27
  Route15 0.203: v10.38,7.27 10.79,7.27 12.94,5.12 14.08,5.12 14.28,4.92 15.11,4.92 15.37,5.18 15.37,5.53 14.71,6.19 U$4.POWER_3
  other vias: 14.69,6.19
GH_CTOP_1  (via drill 0.2)
  Route2 0.203: U$26.G 18.78,33.59 v14.43,29.24
  Bottom 0.203: v14.43,29.24 14.43,29.5 U$6.POWER_1
  other vias: 18.78,34.62
GL_ABOT_3  (via drill 0.2)
  Top 0.203: U$21.33-GL_A v12.88,7.27
  Route2 0.203: 12.88,7.23 v12.88,7.27 12.79,7.19 12.79,7.14 12.51,6.85 11.29,6.85 10.01,5.57 9.77,5.32 9.5,5.32 8.73,4.55 8.73,4.09 U$9.POWER_3
  other vias: 8.57,3.93
GL_ATOP_2  (via drill 0.2)
  Bottom 0.203: U$3.POWER_4 8.61,27.58 U$25.G
  other vias: 8.34,27.58
GL_BBOT_3  (via drill 0.2)
  Top 0.203: U$21.32-GL_B v12.38,7.32 v12.37,7.31
  Route2 0.203: v12.37,7.31 12.46,7.4 12.46,7.45 12.71,7.69 13.56,7.69 13.8,7.45 13.8,7.1 13.3,6.6 12.92,6.6 12.68,6.36 12.68,4.35 U$4.POWER_2
  other vias: 13.09,3.94
GL_BTOP_2  (via drill 0.2)
  Top 0.203: U$6.POWER_4 13.11,27.58 U$23.G
  other vias: 13.09,27.57
GL_CBOT_3  (via drill 0.2)
  Top 0.089: U$21.25-GL_C 8.86,7.85 8.87,7.84 v8.87,7.21 | U$4.POWER_1 14.69,4.84 14.56,4.98 14.3,4.98 14.01,5.27 11.38,5.27 v11.24,5.13
  Route15 0.089: v8.87,7.21 8.92,7.21 9.22,6.91 9.46,6.91 v11.24,5.13
GL_CTOP_1  (via drill 0.2)
  Top 0.203: v19.75,27.58 U$28.G
  Route15 0.203: v19.75,27.58 19.75,28.97 19.1,29.62 15.4,29.62 14.3,28.52 v14.3,28.18
  Bottom 0.203: v14.3,28.18 14.69,27.79 U$6.POWER_3
GND  (via drill 0.2, 0.45, 1)  (1 unrouted)
  Top 0.089: C6.2 0002.1 C1.2 | C45.2 0019.1 | v14.53,10.61 14.04,10.61 13.87,10.78 12.47,10.78 12.31,10.95 | U$21.POWERPAD 11.63,11.63 12.31,10.95 | v11.63,9.14 11.63,10.38 | 11.63,10.38 11.63,10.44 11.72,10.53 11.89,10.53 12.31,10.95 | U$21.POWERPAD 11.65,12.12 13.01,13.48 14.68,13.48 14.79,13.37 U$21.45-GND2 16.53,13.37 17.21,14.06 18.64,14.06 C36.2 C39.2 | U$21.14-GND1 7.41,14.4 7.96,14.4 8.23,14.13 v8.75,14.13 9.99,14.13 10.03,14.17 11.63,12.58 U$21.POWERPAD | U$21.9-NSCS | U2.26 13.13,14.33 11.63,12.82 11.63,11.75 | C34.2 R24.1 4.62,13.28 v4.73,13.17 | U$21.21-SN2 U$21.22-SP2 8.45,10.37 8.58,10.24 8.88,10.24 9.01,10.38 11.63,10.38 | 10.95,6.18 U$9.PAD_2 10.92,5.33 10.88,5.28 10.88,3.96 10.85,3.94 | 10.95,6.18 U$4.PAD_4 | U$4.PAD_2 U$9.PAD_4 10.85,3.94 | 10.85,3.94 U$9.POWER_4 | U$9.POWER_4 | U$9.PAD_3 8.16,3.59 8.16,3.58 8.24,3.5 9.75,3.5 U$9.POWER_4 | U$4.PAD_1 15.59,4.08 16.06,4.08 16.27,4.29 16.27,4.59 15.44,5.42 U$4.PAD_3 | U$9.PAD_1 8.16,5.84 8.16,5.83 8.9,5.09 9.2,5.09 9.69,4.6 9.69,4.43 U$9.POWER_4 | 10.88,6.11 10.95,6.18 | v11.25,5.63 10.95,5.94 10.95,6.18
  Top 0.203: U$5.PAD_1 7.82,22.14 | 7.82,22.14 U$5.PAD_3 | 10.92,22.14 U$5.PAD_2 U$1.PAD_4 12.34,22.11 | 10.92,22.14 U$5.PAD_4 | 10.92,22.14 7.82,22.14 | U$5.PAD_4 U$1.PAD_2 12.34,22.11 | U$1.PAD_3 15.44,22.11 | 15.44,22.11 U$1.PAD_1 | 12.34,22.11 15.44,22.11 | U$5.POWER_4 U$5.PAD_4
  Top 0.61: 9.73,27.81 9.88,27.96 12.22,27.96 12.28,27.9 U$23.S1 | U$23.S1 12.28,27.38 | 12.28,27.38 12.1,27.2 | 10.05,27.2 9.87,27.38 9.87,27.55 12.24,27.55 U$23.S1 | 12.28,27.38 12.28,27.28 v12.24,27.24 v12.24,28.41 | v12.24,28.41 v12.24,28.99 v11.07,28.99 | v11.07,28.99 v11.07,28.41 v11.66,28.41 v12.24,28.41 | v12.24,28.41 11.99,28.66 11.33,28.66 | 12.28,27.2 9.73,27.2 | v10.49,27.83 v10.49,28.99 v11.07,28.99
  Route2 0.089: v6.98,4.74 4.79,4.74 C45.2 | 0019.1 4.71,8.11 4.71,13.15 v4.73,13.17 | v8.75,14.13 10.38,15.76 U$21.9-NSCS
  Route15 0.089: C1.2 19.47,12.86 19.11,13.22 19.11,13.52 19.47,13.88 C36.2 | v8.75,14.13 8.62,14 8.38,14 7.55,13.17 v4.73,13.17
  Bottom 0.089: U$31.2 7.01,4.71 v6.98,4.74 | 0019.1 C49.2 C3.1 | U2.36 14.54,10.39 | 14.54,10.39 v14.54,10.61 U2.35 15.79,10.62 17.17,12 C13.2 | 14.54,10.39 14.53,10.39 v14.53,10.61 | v11.63,9.14 U2.5 11.63,7.53 11.74,7.42 11.74,5.87 C2.1 11.32,5.56 v11.25,5.63 | v8.75,14.13 U2.18 7.8,14.12 U$2.PAD_2 | C5.2 16.46,15.66 U$11.3 17.24,14.88 C36.2 | U$2.POWER_1 U$2.PAD_1 U$2.PAD_3 4.49,17.26 4.49,17.27 4.57,17.35 6.83,17.35 6.91,17.27 6.91,17.26 U$2.PAD_4
  Bottom 0.152: U$3.SIGNAL_3 U$3.POWER_3
  Bottom 0.203: U$8.POWER_2 U$5.POWER_4 | 17.07,33.13 17.83,33.13 | 5.49,32.7 0014.1 | 13.55,31.19 11.66,29.3 v11.66,28.99
  Bottom 0.61: 6.66,33.77 6.66,33.98 16.5,33.98 16.5,33.81 | 3.14,32.08 19.24,32.08 19.33,31.99 19.33,31.66 19.34,31.65 3.63,31.65 3.62,31.64 3.72,31.53 3.72,31.19 13.55,31.19 13.82,31.47 15.05,31.47 15.33,31.19 19.77,31.19 19.93,31.34
  Bottom 1.27: v3.15,30.59 v3.15,31.86 v3.15,33.13 | v3.15,33.13 v3.15,34.4 | v3.15,33.13 3.15,33.39 0014.1 0015.1 17.83,33.13 v20.17,33.13 | v20.17,34.4 v20.17,33.13 | v20.17,33.13 v20.17,31.86 v20.17,30.59
  other vias: 3.85,7.24 3.85,5.68 19.47,7.28 19.47,5.71 19.47,8.79 19.47,14.88 10.38,16.37 13.13,15.02 4.15,14.67 10.17,21.02 11.07,27.24 11.07,27.83 11.66,27.83 12.24,27.83 10.49,27.24 10.49,28.41 11.66,27.24 7.32,8.19 8.61,9.16 16.36,6.32
  pour Top: 0,0 0,44.25 23.3,44.26 23.3,0
  pour Route2: 0,0 0,44.26 23.3,44.26 23.3,0
  pour Route15: 0,0 0,44.26 23.3,44.26 23.3,0
  pour Bottom: 0,0 0,44.26 23.3,44.26 23.3,0
GND_A  (via drill 0.2)
  Route15 0.203: v13.69,28.24 12.81,29.12 12.81,29.23 8.27,33.77 3.73,33.77 3.15,33.19
  Bottom 0.089: U$6.SIGNAL_4 v13.69,28.24
GND_C  (via drill 0.2)
  Route15 0.203: v13.92,29.15 14.01,29.24 14.01,29.41 14.86,30.26 15.91,30.26 19.42,33.77
  Bottom 0.203: U$6.SIGNAL_1 14.09,29.49 14.01,29.41 14.01,29.24 v13.92,29.15
INH_A  (via drill 0.2)
  Bottom 0.089: 14.1,13.62 U2.29 14.79,13.87 15.09,13.87 15.17,13.95 15.17,14.54 13.88,15.83 U$21.2-INHA
  other vias: 13.88,16.37
INH_B  (via drill 0.2)
  Top 0.089: U$21.4-INHB
  Route2 0.089: v8.73,11.61 8.87,11.76 9.38,11.76 12.6,14.97 12.6,15.24 12.88,15.53 U$21.4-INHB
  Bottom 0.089: U2.13 v8.73,11.61
  other vias: 12.88,16.37
INH_C  (via drill 0.2)
  Top 0.089: U$21.6-INHC v11.88,16.58
  Bottom 0.089: v11.88,16.58 11.74,16.45 11.74,16.22 11.53,16.01 11.27,16.01 10.73,15.47 10.64,15.47 10.63,15.46 U2.21
INL_A  (via drill 0.2)
  Top 0.089: v13.38,16.59 U$21.3-INLA
  Route2 0.089: v13.38,16.59 13.24,16.45 13.24,15.63 12.77,15.16 12.77,14.87 13.08,14.56 13.08,12.67 U2.9
  Bottom 0.089: U2.9
  other vias: 9.63,9.22
INL_B  (via drill 0.2)
  Route2 0.089: U2.14 11.27,14.66 11.27,15.17 12.38,16.27 U$21.5-INLB
  Bottom 0.089: U2.14
  other vias: 8.73,12.12 12.38,16.37
INL_C  (via drill 0.2)
  Bottom 0.089: U$21.7-INLC 10.65,15.65 10.46,15.65 10.13,15.32 U2.20
  other vias: 11.38,16.37
INPUT  (via drill 0.2)
  Route15 0.089: v8.72,12.62 8.54,12.81 4.58,12.81 4.37,13.02 4.37,13.82 4.88,14.33 v4.88,16.94
  Bottom 0.089: v8.72,12.62 U2.15 | v4.88,16.94 U$2.POWER_3
LED  (via drill 0.2)
  Top 0.089: LED9.A 5.83,16.28 6.22,16.66 6.25,16.66 U$2.POWER_4 6.5,16.84 7.64,15.7 8.36,15.7 v8.41,15.75
  Bottom 0.089: U2.22 10.88,14.76 10.88,14.46 10.8,14.38 9.96,14.38 9.88,14.46 9.88,15.57 9.75,15.7 8.46,15.7 v8.41,15.75
  other vias: 6.5,16.92
N$1
  Route15 0.203: 19.42,33.77 20.05,33.13 20.18,33.13
N$3  (via drill 0.2)
  Bottom 0.203: U$5.POWER_3 U$8.POWER_1
  other vias: 8.57,21.02
N$4  (via drill 0.2)
  Top 0.203: U$5.SIGNAL_3 v9.17,21.51
  Bottom 0.203: v9.17,21.51 U$8.SIGNAL_1
N$5  (via drill 0.2)
  Top 0.203: v9.67,21.6 9.67,21.02 U$5.SIGNAL_4
  Bottom 0.203: 9.67,21.42 | 9.67,21.42 v9.67,21.6 | U$8.SIGNAL_2 9.67,21.14 9.67,21.42
N$7  (via drill 0.2)
  Top 0.203: U$7.POWER_1 U$1.POWER_3
  other vias: 14.69,23.24
N$8  (via drill 0.2)
  Top 0.203: v14.1,22.78 U$1.SIGNAL_3
  Bottom 0.203: U$7.SIGNAL_1 v14.1,22.78
N$9  (via drill 0.2)
  Top 0.203: U$1.SIGNAL_4 13.59,23.27 v13.59,22.68
  Bottom 0.203: v13.59,22.68 13.59,22.86 | 13.59,22.86 | 13.59,22.86 13.59,23.14 U$7.SIGNAL_2
N$10
  Top 0.203: C36.1 17.71,14.88 16.7,13.87 U$21.46-DVDD
N$11  (via drill 0.2)
  Top 0.203: U$1.POWER_4 U$7.POWER_2
  other vias: 13.09,23.24
N$12
  Top 0.203: C34.1 5.95,14.45 5.96,14.45 6.53,13.87 U$21.15-AVDD
N$13
  Top 0.089: 16.41,9.37 U$21.37-VCP_LSD
  Top 0.203: C38.1 17.19,9.37 16.41,9.37
N$14
  Top 0.089: 17.71,11.87 C31.2
  Top 0.203: U$21.42-CP1L 17.71,11.87
N$15  (via drill 0.2)
  Top 0.203: U$5.POWER_1 U$8.POWER_3
  other vias: 8.57,23.24
N$16
  Top 0.089: 16.1,12.37 U$21.43-CP1H
  Top 0.203: 16.1,12.37 17.01,12.37 17.14,12.5 18.78,12.5 C31.1
N$17  (via drill 0.2)
  Top 0.203: v9.17,22.78 U$5.SIGNAL_1
  Bottom 0.203: U$8.SIGNAL_3 v9.17,22.78
N$18  (via drill 0.2)
  Top 0.203: U$5.SIGNAL_2 9.67,23.27 v9.67,22.69
  Bottom 0.203: v9.67,22.69 9.67,22.86 | 9.67,22.86 | 9.67,22.86 9.67,23.14 U$8.SIGNAL_4
N$19  (via drill 0.2)
  Top 0.203: U$8.POWER_4 U$5.POWER_2
  other vias: 10.17,23.24
N$20
  Top 0.089: 15.95,10.87 U$21.40-CP2L
  Top 0.203: 15.95,10.87 17.02,10.87 17.14,10.99 18.78,10.99 C32.2
N$21
  Top 0.089: 16.28,10.37 U$21.39-CP2H
  Top 0.203: C32.1 17.7,10.37 16.28,10.37
N$22
  Top 0.089: 16.07,12.87 U$21.44-VDRAIN
  Top 0.203: R13.1 17.27,12.87 16.07,12.87
N$23  (via drill 0.2)
  Bottom 0.203: U$21.38-VCPH 16.36,10.35 C14.2
  other vias: 15.88,9.87
N$24
  Bottom 0.089: C1.1 16.44,8.79 U$10.2 14.5,8.58 13.39,8.58 13.13,8.84 U2.2
N$25  (via drill 0.2)
  Bottom 0.203: U$1.POWER_1 U$7.POWER_3
  other vias: 14.69,21.02
N$26  (via drill 0.2)
  Top 0.203: U$1.SIGNAL_1 v14.1,21.5
  Bottom 0.203: v14.1,21.5 U$7.SIGNAL_3
N$27  (via drill 0.2)
  Top 0.203: v13.59,21.6 13.59,21.02 U$1.SIGNAL_2
  Bottom 0.203: 13.59,21.42 | 13.59,21.42 v13.59,21.6 | U$7.SIGNAL_4 13.59,21.14 13.59,21.42
N$28  (via drill 0.2)
  Bottom 0.203: U$7.POWER_4 U$1.POWER_2
  other vias: 13.09,21.02
N$45
  Bottom 0.089: C3.2 5.55,10.24 5.7,10.09 | 5.55,11.66 R1.2
  Bottom 0.152: 5.7,10.09 5.95,9.84 9.3,9.84 9.35,9.88 10.82,9.88 11.13,9.56 U2.6 | C3.2 5.55,11.66
N$53  (via drill 0.2)
  Top 0.089: v14.45,5.34 15.35,4.44 v15.91,4.44
  Bottom 0.089: C2.2 12.09,3.9 | 12.09,3.9 12.49,4.3 | v14.45,5.34 14.4,5.38 13.52,5.38 13.31,5.59 13.31,5.89 13.45,6.04 13.45,6.34 13.24,6.55 12.63,6.55 12.01,7.16 12.01,7.46 12.63,8.08 U2.3 | v15.91,4.44 15.79,4.44 U$10.1 13.52,4.02 13.45,3.95 13.45,3.79 13.24,3.58 12.41,3.58 12.09,3.9
N$81
  Top 0.089: LED9.C 3.96,15.97 4.69,15.25 4.69,14.22 4.87,14.04 5.26,14.04 5.55,13.74 R24.2
NFAULT  (via drill 0.2)
  Top 0.089: U$21.8-NFAULT 10.88,15.78 U2.23 11.5,15.15 6.57,15.15 6.25,15.48 4.94,15.48 4.87,15.4 4.87,14.29 4.94,14.21 5.86,14.21 6.18,13.89 6.18,12.68 5.55,12.05 R12.1
  Bottom 0.089: U2.23
  other vias: 11.63,15.02
NRST  (via drill 0.2)
  Route15 0.089: U2.4 9.09,12.26 9.09,13.71 9.29,13.91 9.29,14.35 8.97,14.67 5.73,14.67 v4.73,13.68
  Bottom 0.089: U$2.POWER_2 6.5,14.31 5.52,13.33 5.55,13.3 R16.2 5.16,13.68 v4.73,13.68
  other vias: 12.13,9.22
PWRGD
  Top 0.089: 7.34,14.83 U$21.13-PWRGD
SCL  (via drill 0.2)
  Route15 0.089: v7.58,16.28 8.05,15.8 8.05,15.61 8.63,15.02 9.12,15.02 12.52,11.62 U2.33
  Bottom 0.089: U2.33 | U$2.SIGNAL_3 5.5,16.66 6,16.16 6,16.15 6.22,15.94 7.24,15.94 v7.58,16.28
  other vias: 14.53,11.62
SCLK  (via drill 0.2)
  Top 0.089: v8.87,16.39 v8.87,16.38 U$21.12-SCLK
  Route15 0.089: U2.30 11.88,13.12 8.87,16.13 v8.87,16.39
  other vias: 14.53,13.12
SDA  (via drill 0.2)
  Route15 0.089: U2.34 13.38,11.12 | 13.37,11.11 13.38,11.12 | 13.38,11.12 12.52,11.12 9.46,14.17 9.46,14.43 9.04,14.85 6.89,14.85 6.37,15.37 6.37,16.3 v6.37,16.3
  Bottom 0.089: v6.37,16.3 6.18,16.48 6.17,16.48 5.9,16.75 U$2.SIGNAL_4
  other vias: 14.53,11.12
SDI  (via drill 0.2)
  Route15 0.089: v14.75,12.12 14.75,12.32 15.07,12.64 15.07,13.34 14.76,13.65 14.31,13.65 14.13,13.47 12.03,13.47 9.88,15.62 U$21.10-SDI
  Bottom 0.089: U2.32 v14.75,12.12
  other vias: 9.88,16.37
SDO  (via drill 0.2)
  Top 0.089: v9.37,16.37 U$21.11-SDO
  Route15 0.089: v14.53,12.61 14.68,12.76 14.89,12.97 14.89,13.27 14.68,13.48 14.38,13.48 14.2,13.29 11.95,13.29 9.37,15.88 v9.37,16.37
  Bottom 0.089: U2.31 v14.53,12.61
SH_ABOT_3  (via drill 0.2)
  Top 0.089: U$21.35-SH_A 13.88,6.92 13.88,6.91 11.94,6.91 9.69,6.91 9.32,6.54 9.32,6.33 U$9.SIGNAL_1 9.17,5.72 v9.09,5.63 | 0018.2 6.92,4.17 v6.99,4.23
  Route2 0.089: v9.09,5.63 7.89,4.43 7.18,4.43 v6.99,4.23
SH_ATOP_2  (via drill 0.2, 0.45)  (12 unrouted)
  Top 0.089: 8.51,31.39 7.21,31.39 | 7.21,31.39 U$25.D1 | v8.39,30.39 8.22,30.39 7.21,31.39
  Top 0.61: v4.37,35.34 v7.29,35.34 v7.29,34.76 v4.37,34.76 v4.37,35.34
  Top 0.813: v4.95,34.76 v5.54,34.76 | U$24.S2 5.8,34.76 v6.12,34.76 v6.71,34.76 | 4.95,33.3 U$25.D4
  Top 1.016: U$24.S2 5.8,34.14 | 5.8,34.14 U$25.D4 U$25.D3 | U$24.S2 5.17,34.62 5.17,33.3 | U$24.S2 U$24.S1 U$25.D3 | U$25.D3 7.07,34.14 5.8,34.14 | U$25.D1 6.44,33.3
  Bottom 0.089: U$3.SIGNAL_2 9.07,29.93 9.07,30.12 8.99,30.2 8.58,30.2 v8.39,30.39
  Bottom 0.61: v4.37,35.34 v7.29,35.34 | v7.29,35.34 7.29,35.36 | v7.29,35.34 v7.29,34.76 | v7.29,34.76 v4.37,34.76 v4.37,35.34 | v4.37,35.34 4.37,40.31 4.92,40.31 | 5.79,40.31 4.92,40.31 | 4.92,40.31 4.92,35.43 | v7.29,34.76 7.29,36.09 7.18,36.09 | v7.29,34.76 7.82,34.76 7.82,40.31 7.21,40.31
  Bottom 0.813: 5.54,38.08 M_A.1 6.44,36.65 | 6.1,36.54 6.21,36.54 6.21,36.65 | 6.21,36.65 6.21,36.99 | 6.44,36.65 6.21,36.65 | 6.44,36.65 6.71,36.65 | 7.29,36.63 7.3,36.63 7.3,36.64
  other vias: 4.95,35.34 5.54,35.34 6.12,35.34 6.71,35.34
SH_BBOT_3  (via drill 0.2)
  Top 0.089: 11.38,7.45 U$21.30-SH_B v11.38,7.27 | v9.6,5.74 9.6,6.16 U$9.SIGNAL_2
  Route2 0.089: v11.38,7.27 9.85,5.74 v9.6,5.74
  Bottom 0.089: v9.6,5.74 9.45,5.6 9.45,5.48 9.22,5.25 6.63,5.25 0020.2
SH_BTOP_2  (via drill 0.2, 0.45)  (19 unrouted)
  Top 0.089: U$23.D1 11.66,30.53 11.56,30.43 9.77,30.43 v9.61,30.28
  Top 0.61: 9.16,35.36 12.66,35.36 v12.68,35.34 v12.68,34.76 v9.17,34.76 v9.17,35.34
  Bottom 0.089: U$3.SIGNAL_1 9.62,30.27 v9.61,30.28
  Bottom 0.61: v12.68,35.34 v12.68,34.76 v9.17,34.76 v9.17,35.34 | v12.68,35.34 v9.17,35.34 | v12.68,35.34 12.68,40.31 9.17,40.31 v9.17,35.34 | v9.17,35.34 9.64,35.34 9.64,39.88 10.15,39.88 10.15,35.52
  other vias: 9.75,35.34 10.34,35.34 10.92,35.34 11.51,35.34 12.09,35.34 9.75,34.76 10.34,34.76 10.92,34.76 11.51,34.76 12.09,34.76
SH_CBOT_3  (via drill 0.2)
  Top 0.089: v13.67,5.74 13.69,5.76 U$4.SIGNAL_4 | v9.88,8.4 U$21.27-SH_C
  Top 0.203: U$21.27-SH_C
  Route2 0.089: v13.67,5.74 13.67,6.64 14.04,7 14.04,7.54 13.65,7.92 11.11,7.92 11.03,7.84 10.45,7.84 v9.88,8.4
  Bottom 0.089: 0016.2 16.23,5.74 v13.67,5.74
SH_CTOP_1  (via drill 0.2, 0.45)  (15 unrouted)
  Top 0.089: v14.96,30.68 16.16,30.68 U$28.D1
  Top 0.152: v14.97,35.34 v15.56,35.34 v15.56,34.76 | v16.73,34.76 16.22,34.76
  Top 0.61: v14.39,35.34 v15.56,35.34 v17.89,35.34 v17.89,34.76 16.22,34.76 v14.39,34.76 v14.39,35.34
  Bottom 0.089: U$6.SIGNAL_2 13.84,29.91 13.84,30.13 14.21,30.49 14.78,30.49 v14.96,30.68
  Bottom 0.61: v14.39,35.34 v17.89,35.34 | v17.89,35.34 v17.89,34.76 v14.39,34.76 v14.39,35.34 | v14.39,35.34 14.39,40.31 17.89,40.31 v17.89,35.34 | v17.89,35.34 15.49,35.34 15.49,39.93 14.94,39.93 14.94,35.36
  other vias: 16.14,35.34 16.73,35.34 17.31,35.34 17.31,34.76 16.14,34.76 14.97,34.76
SL_ABOT_3  (via drill 0.2)
  Top 0.089: 8.77,4.5 8.76,4.5 | 8.76,4.5 7.79,4.5 6.75,5.54 6.75,7.27 6.1,7.92 4.5,7.92 4.05,8.37 3.95,8.37 | U$9.SIGNAL_3 9.15,3.96 v9.15,4.38 8.88,4.38 8.76,4.5 | C42.1 3.95,8.85 | 3.95,8.85 4.73,9.63 6.15,9.63 6.4,9.87 U$21.23-SN1 | 3.95,8.34 3.95,8.37 | 3.95,8.37 3.95,8.85
  Top 0.203: U$21.34-SL_A v13.38,7.28 v13.38,7.27
  Route2 0.089: v13.38,7.27 13.24,7.13 13.24,7.12 12.95,6.84 12.82,6.84 12.6,6.62 11.39,6.62 10.25,5.47 9.87,5.09 9.86,5.09 v9.15,4.38
SL_ATOP_2  (via drill 0.45)  (17 unrouted)
  Top 0.61: v3.57,27.81 v7.06,27.81 7.05,27.8 7.05,27.25 3.57,27.25 3.56,27.24
  Bottom 0.203: U$3.SIGNAL_4 9.22,27.29 9.01,27.08 5.49,27.08 0014.2
  other vias: 3.57,27.23 4.15,27.81 4.15,27.23 4.74,27.23 4.74,27.81 5.32,27.23 5.32,27.81 5.91,27.81 5.91,27.23 6.49,27.23 6.49,27.81 7.07,27.23
SL_BOT_3
  Top 0.089: U$9.SIGNAL_4 9.51,4 9.51,4.53 9.12,4.92 8.38,4.92 7.46,5.83 7.46,7.55 8.68,8.76 9.92,8.76 10.45,9.3 10.75,9.3 10.96,9.09 10.96,8.91 11.12,8.75 11.58,8.75 11.76,8.57 11.94,8.57 11.94,7.93 U$21.31-SL_B
SL_C_2<2  (via drill 0.2)
  Top 0.089: U$21.26-SL_C 9.38,8.46 9.37,8.47 v9.37,7.28 v9.37,7.27 | v7.38,11.88 U$21.19-SN3 6.79,11.87 6.49,11.58 6.49,11.46 5.93,10.89 4.48,10.89 C44.1 | U$4.SIGNAL_1 14.09,4.4 v14.05,4.45
  Route2 0.089: U$21.19-SN3 v7.38,11.88
  Route15 0.089: v14.05,4.45 13.85,4.45 13.71,4.31 13.17,4.31 10.74,6.73 10.15,6.73 9.62,7.27 v9.37,7.27 7.63,9.01 7.23,9.01 7.01,9.23 7.01,11.52 7.22,11.73 7.23,11.73 v7.38,11.88
SL_CTOP_1  (via drill 0.45)  (18 unrouted)
  Top 0.61: v15.6,27.22 v15.6,28.37 v15.61,28.38 17.96,28.38 | 17.96,28.38 17.97,28.4 | 17.96,28.38 17.91,28.33 17.91,27.2 15.96,27.2 15.8,27.37 16.2,27.77 17.75,27.77
  Bottom 0.203: U$6.SIGNAL_3 14.09,27.06 17.83,27.06 0015.2
  other vias: 15.6,27.8 16.18,27.8 16.76,27.8 17.35,27.8 17.93,27.8 17.35,27.22 17.93,27.22 16.18,27.22 16.76,27.22 16.18,28.38 16.76,28.38 17.35,28.38 17.93,28.38
SO1  (via drill 0.2)
  Top 0.089: v8.73,13.13 8.24,13.13 7.99,13.39 7.39,13.39 U$21.16-SO1
  Bottom 0.089: v8.73,13.13 U2.16
SO3  (via drill 0.2)
  Top 0.089: v8.73,11.11 8.58,11.25 8.37,11.46 8.37,11.97 7.96,12.37 U$21.18-SO3
  Bottom 0.089: v8.73,11.11 U2.12
SP_ABOT_3  (via drill 0.2)
  Top 0.089: C42.2 6.17,9.37 U$21.24-SP1 | 13.67,3.91 U$4.SIGNAL_2 13.69,4.29 13.69,4.3 13.69,4.53 v13.56,4.67
  Route15 0.089: U$21.24-SP1 7.79,9.37 10.02,7.15 10.02,7.12 10.23,6.91 10.82,6.91 13.06,4.67 v13.56,4.67
  other vias: 7.38,9.37
SP_CBOT_3  (via drill 0.2)
  Top 0.089: U$21.20-SP3 v7.37,11.37 6.66,11.37 C44.2 | U$4.SIGNAL_3 14.29,6 14.29,5.83 14.42,5.7 14.6,5.7 v14.95,5.35
  Route15 0.089: v14.95,5.35 14.6,5.7 14.3,5.7 13.95,5.35 13.38,5.35 11.74,7 11.74,7.42 11.53,7.63 10.94,7.63 10.24,8.32 10.24,8.55 10.03,8.76 9.58,8.76 9.27,9.07 9.27,9.46 v7.37,11.37
SWCLK
  Bottom 0.089: U$2.SIGNAL_2 6.09,14.86 6.09,15.02 6.17,15.1 8.55,15.1 9.37,14.29 9.37,14.2 9.52,14.05 14.47,14.05 U2.28
SWDIO  (via drill 0.2)
  Route15 0.089: v14.14,15.02 14,14.88 14,14.87 13.63,14.5 11.25,14.5 10.74,15.01 10.74,16.52 10.51,16.75 7.54,16.75 7.21,16.43 7.21,16 v6.73,15.51 6.77,15.51
  Bottom 0.089: U2.25 12.77,15.15 12.77,15.46 12.96,15.65 13.8,15.65 14,15.45 14,15.17 v14.14,15.02 | U$2.SIGNAL_1 5.5,15.1 5.68,15.28 6.16,15.28 6.39,15.51 v6.73,15.51
VA  (via drill 0.2)
  Top 0.089: v4.73,7.23 4.75,7.24 0019.2 C45.1 5.36,5.68 0018.1 v4.67,4.17
  Route2 0.089: v4.73,7.23 4.75,7.24 8.21,7.24 9.73,8.76 10.43,8.76 v10.6,8.94
  Bottom 0.089: v10.6,8.94 10.63,8.97 U2.7 | v4.67,4.17 4.92,3.92 4.92,3.56 4.99,3.48 6.1,3.48 6.38,3.76 U$31.1
VB
  Bottom 0.089: 0020.1 5.36,5.68 5.5,5.68 | 5.5,5.68 C46.1 0021.2 | U2.8 10.13,8.66 10.24,8.55 10.24,8.26 9.62,7.63 7.14,7.63 6.83,7.32 6.83,6.11 7.24,5.71 7.24,5.66 | U$31.3 7.24,5.66 | 7.24,5.66 5.52,5.66 5.5,5.68
VC  (via drill 0.2)
  Top 0.089: v17.05,6.5 17.05,6.38 16.54,5.86 16.54,5.4 v16.3,5.16
  Route15 0.089: v15.15,8.68 17.05,6.78 v17.05,6.5
  Bottom 0.089: 0016.1 19.28,4.2 C47.1 0017.2 | 0017.2 17.63,7.41 17.63,7.08 v17.05,6.5 | U2.10 13.73,10.12 15.15,8.7 v15.15,8.68 | U$31.4 9.89,5.12 9.88,5.12 9.8,5.04 9.8,4.38 10.01,4.17 10.86,4.17 11.57,4.88 12.61,4.88 12.93,5.21 14.07,5.21 14.3,4.98 14.6,4.98 14.61,4.99 15.1,4.99 15.27,5.16 v16.3,5.16 | 0017.2 17.77,7.55
VMOTOR  (via drill 0.2)
  Top 0.089: 0001.2 19.46,4.22 | 15.23,11.31 15.23,11.43 15.82,11.43 U$21.41-PVDD
  Top 0.203: v18.62,4.2 19.44,4.2 19.46,4.22
  Route15 0.203: U$9.POWER_1 8.57,5.96 8.49,5.88 8.49,5.39 8.84,5.04 9.36,5.04 10.88,3.52 17.93,3.52 v18.62,4.2 18.62,7.89 v18.65,7.92
  Bottom 0.089: 18.76,12.12 C13.1 19.06,12.1 19.06,12.19 | 19.06,10.48 C14.1 | 19.47,14.07 U$11.2
  Bottom 0.203: v18.65,7.92 18.65,8.1 18.69,8.14 18.69,10.1 19.06,10.48 | C14.1 19.06,12.19 | U$21.41-PVDD 16.33,11.83 16.33,12.95 16.44,13.06 17.9,13.06 18.84,12.12 C13.1 19.07,12.98 R13.2 19.47,14.07
  other vias: 15.88,11.37 19.47,13.37 8.57,6.18
VMOTOR_TOP  (via drill 0.2, 1)
  Top 1.27: v3.15,39 v3.15,40.27 3.15,40.34 U$24.D5 U$24.D4 U$24.D3 U$24.D2 U$22.D5 U$22.D4 U$22.D3 U$22.D2 U$26.D5 U$26.D4 U$26.D3 U$26.D2 20.17,40.34 v20.17,40.27 v20.17,39 | v3.15,39 v3.15,37.73 | v3.15,37.73 v3.15,36.46 | v3.15,39 3.2,39.06 3.53,39.06 3.7,39.23 6.44,39.23 U$24.D1 6.44,38.42 4.04,38.42 | v3.15,37.73 3.92,37.73 3.92,38.42 4.04,38.42 | v3.15,36.46 4.04,36.46 4.04,38.42 | v20.17,39 v20.17,37.73 | v20.17,37.73 v20.17,36.46 | v20.17,39 18.96,38.99 | 18.96,38.99 18.96,39.67 18.67,39.67 18.49,39.49 17.53,39.49 17.03,39.99 | 17.03,39.99 17.03,40.2 | 17.03,39.99 17.03,38.43 | 17.03,38.43 U$26.D1 14.33,38.43 14.33,39.41 14.28,39.41 14.28,36.45 | v20.17,37.73 18.96,37.72 18.96,38.99 | v20.17,36.46 18.52,36.45 18.52,38.43 17.03,38.43 | v20.17,36.46 14.28,36.45 | 14.28,36.45 9.09,36.45 | 9.09,36.45 3.15,36.45 v3.15,36.46 | U$22.D1 8.88,38.43 | 8.88,38.43 8.88,39.65 | 8.88,38.43 8.88,37.19 9.09,37.19 | 9.14,37.19 9.09,37.19 | 9.09,37.19 9.09,36.45
  Route2 0.203: v8.62,29.18 8.62,29.57 7.86,30.33 7.86,35.58 6.97,36.46 v3.15,36.46
  Bottom 0.203: U$3.POWER_2 v8.62,29.18
VV  (via drill 0.2)
  Top 0.089: 0002.2 C6.1 | C6.1 17.77,4.23 | 17.77,4.23 0001.1 | v16.95,4.2 17.74,4.2 17.77,4.23 | C6.1 v16.9,5.71
  Route15 0.089: v16.9,5.71 15.86,5.71 13.48,8.1 | 13.48,8.1 | v8.73,10.6 9.45,10.6 11.95,8.1 12.51,8.1 13.48,8.1
  Bottom 0.089: 9.1,10.62 U2.11 v8.73,10.61 v8.73,10.6 | v16.95,4.2 16.5,4.66 16.5,4.72 16.42,4.8 14.23,4.8 14,5.03 13.01,5.03 12.68,4.7 11.65,4.7 10.71,3.76 U$31.6
WAKE  (via drill 0.2)
  Top 0.089: U$21.47-WAKE
  Route2 0.089: v8.53,13.64 8.66,13.77 8.9,13.77 11.02,15.89 11.02,16.52 11.44,16.95 14.31,16.95 16.24,15.02 16.24,14.72 16.03,14.51 16.02,14.51 U$21.47-WAKE
  Bottom 0.089: U2.17 8.55,13.62 v8.53,13.64
  other vias: 15.88,14.37